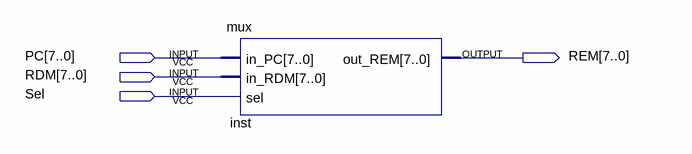
[diagram p0: schematic sheet]
// Quartus schematic test.bdf as structural Verilog: 1 symbols, 4 pins
module test (
  input  [7:0] PC,
  input  [7:0] RDM,
  input  Sel,
  output [7:0] REM
);

  mux inst (.in_PC(PC), .in_RDM(RDM), .sel(Sel), .out_REM(REM));
endmodule
